# Altium project нижняя плата 2.0.PrjPcb
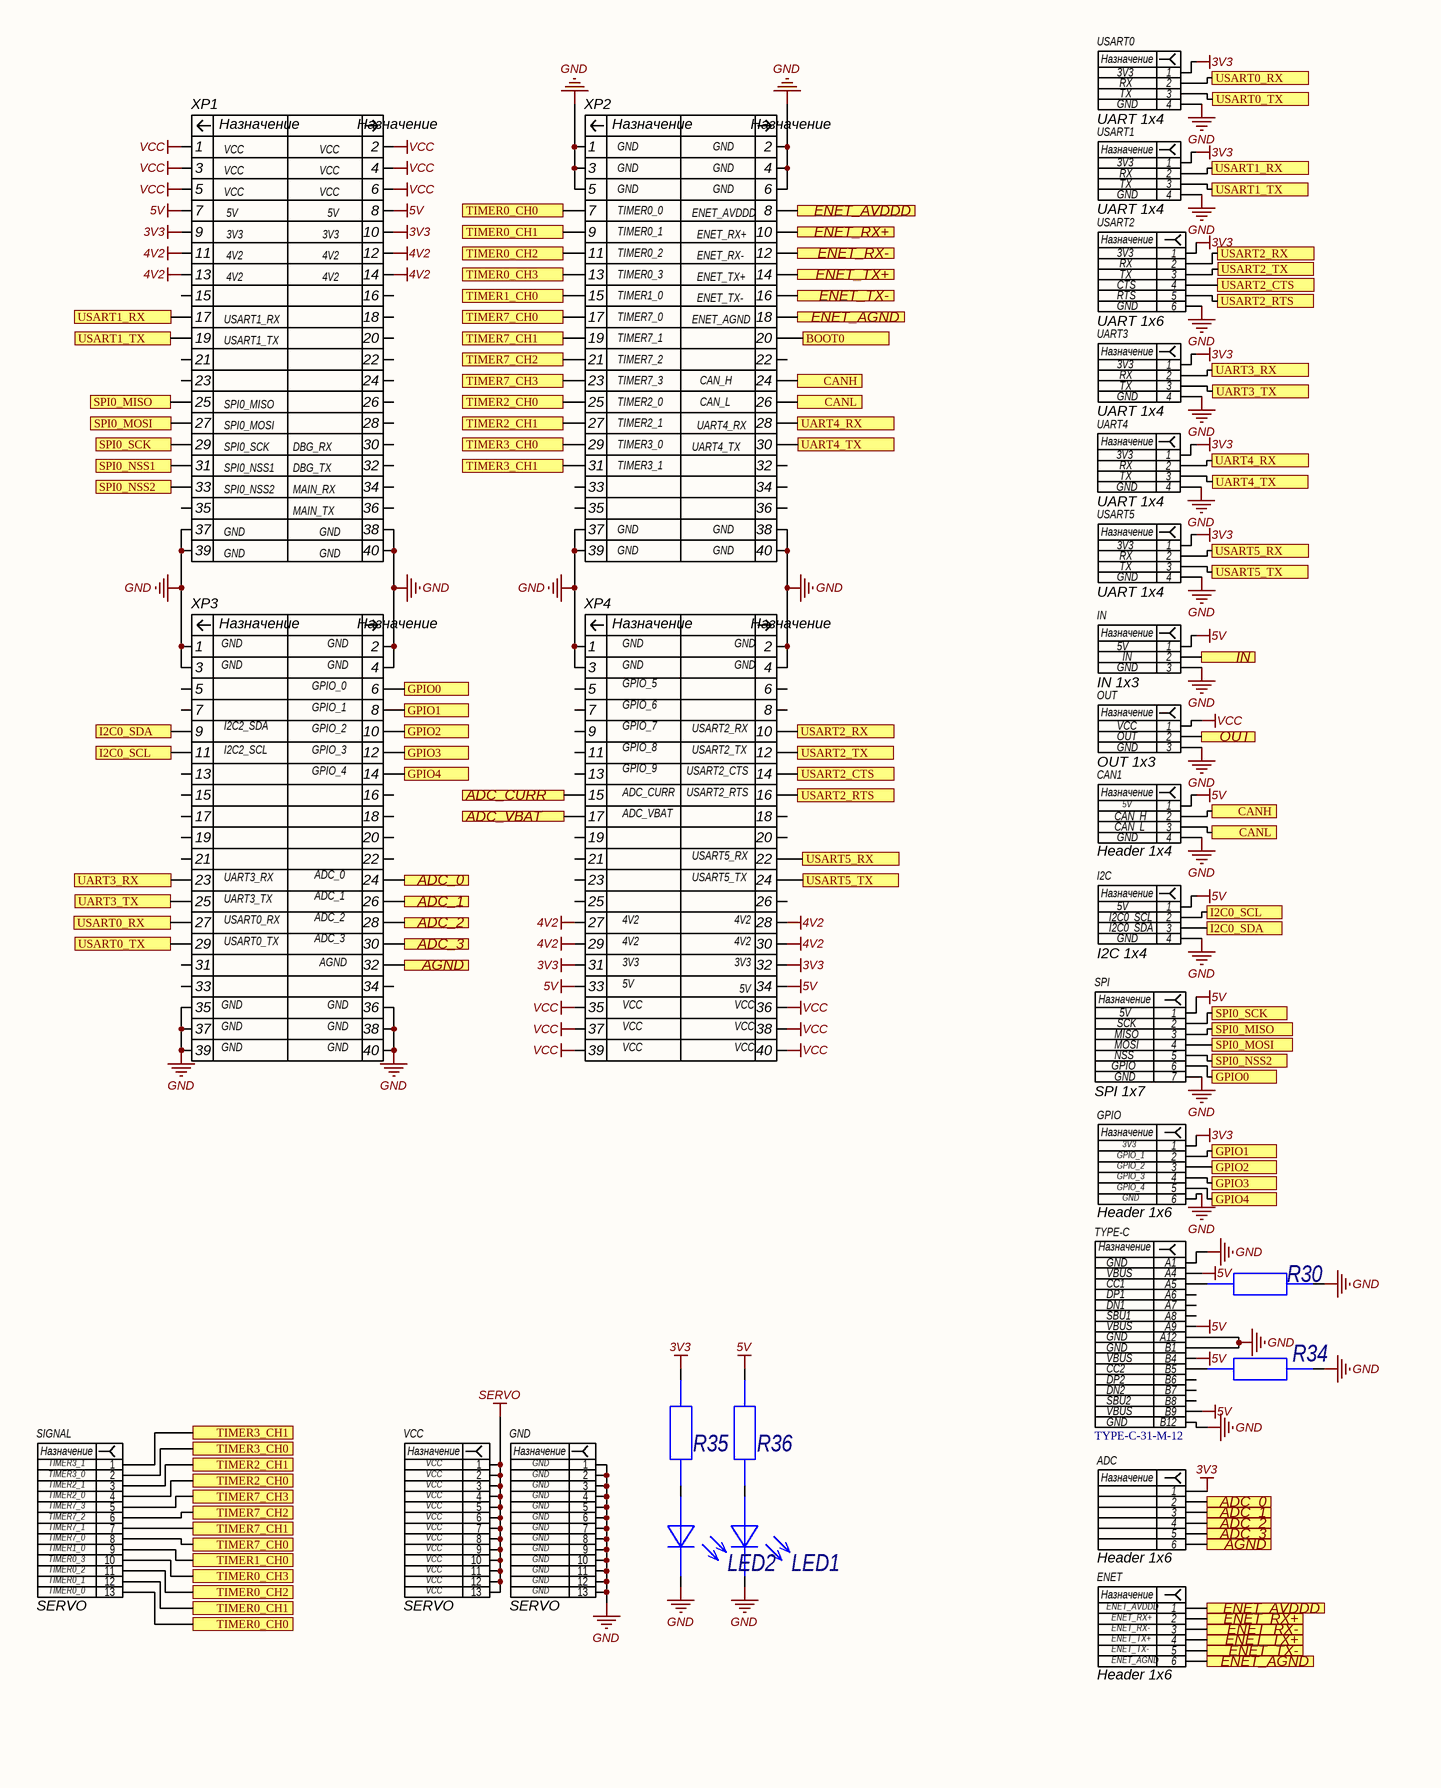
[diagram p0: нижняя плата версия 2.SchDoc, left]
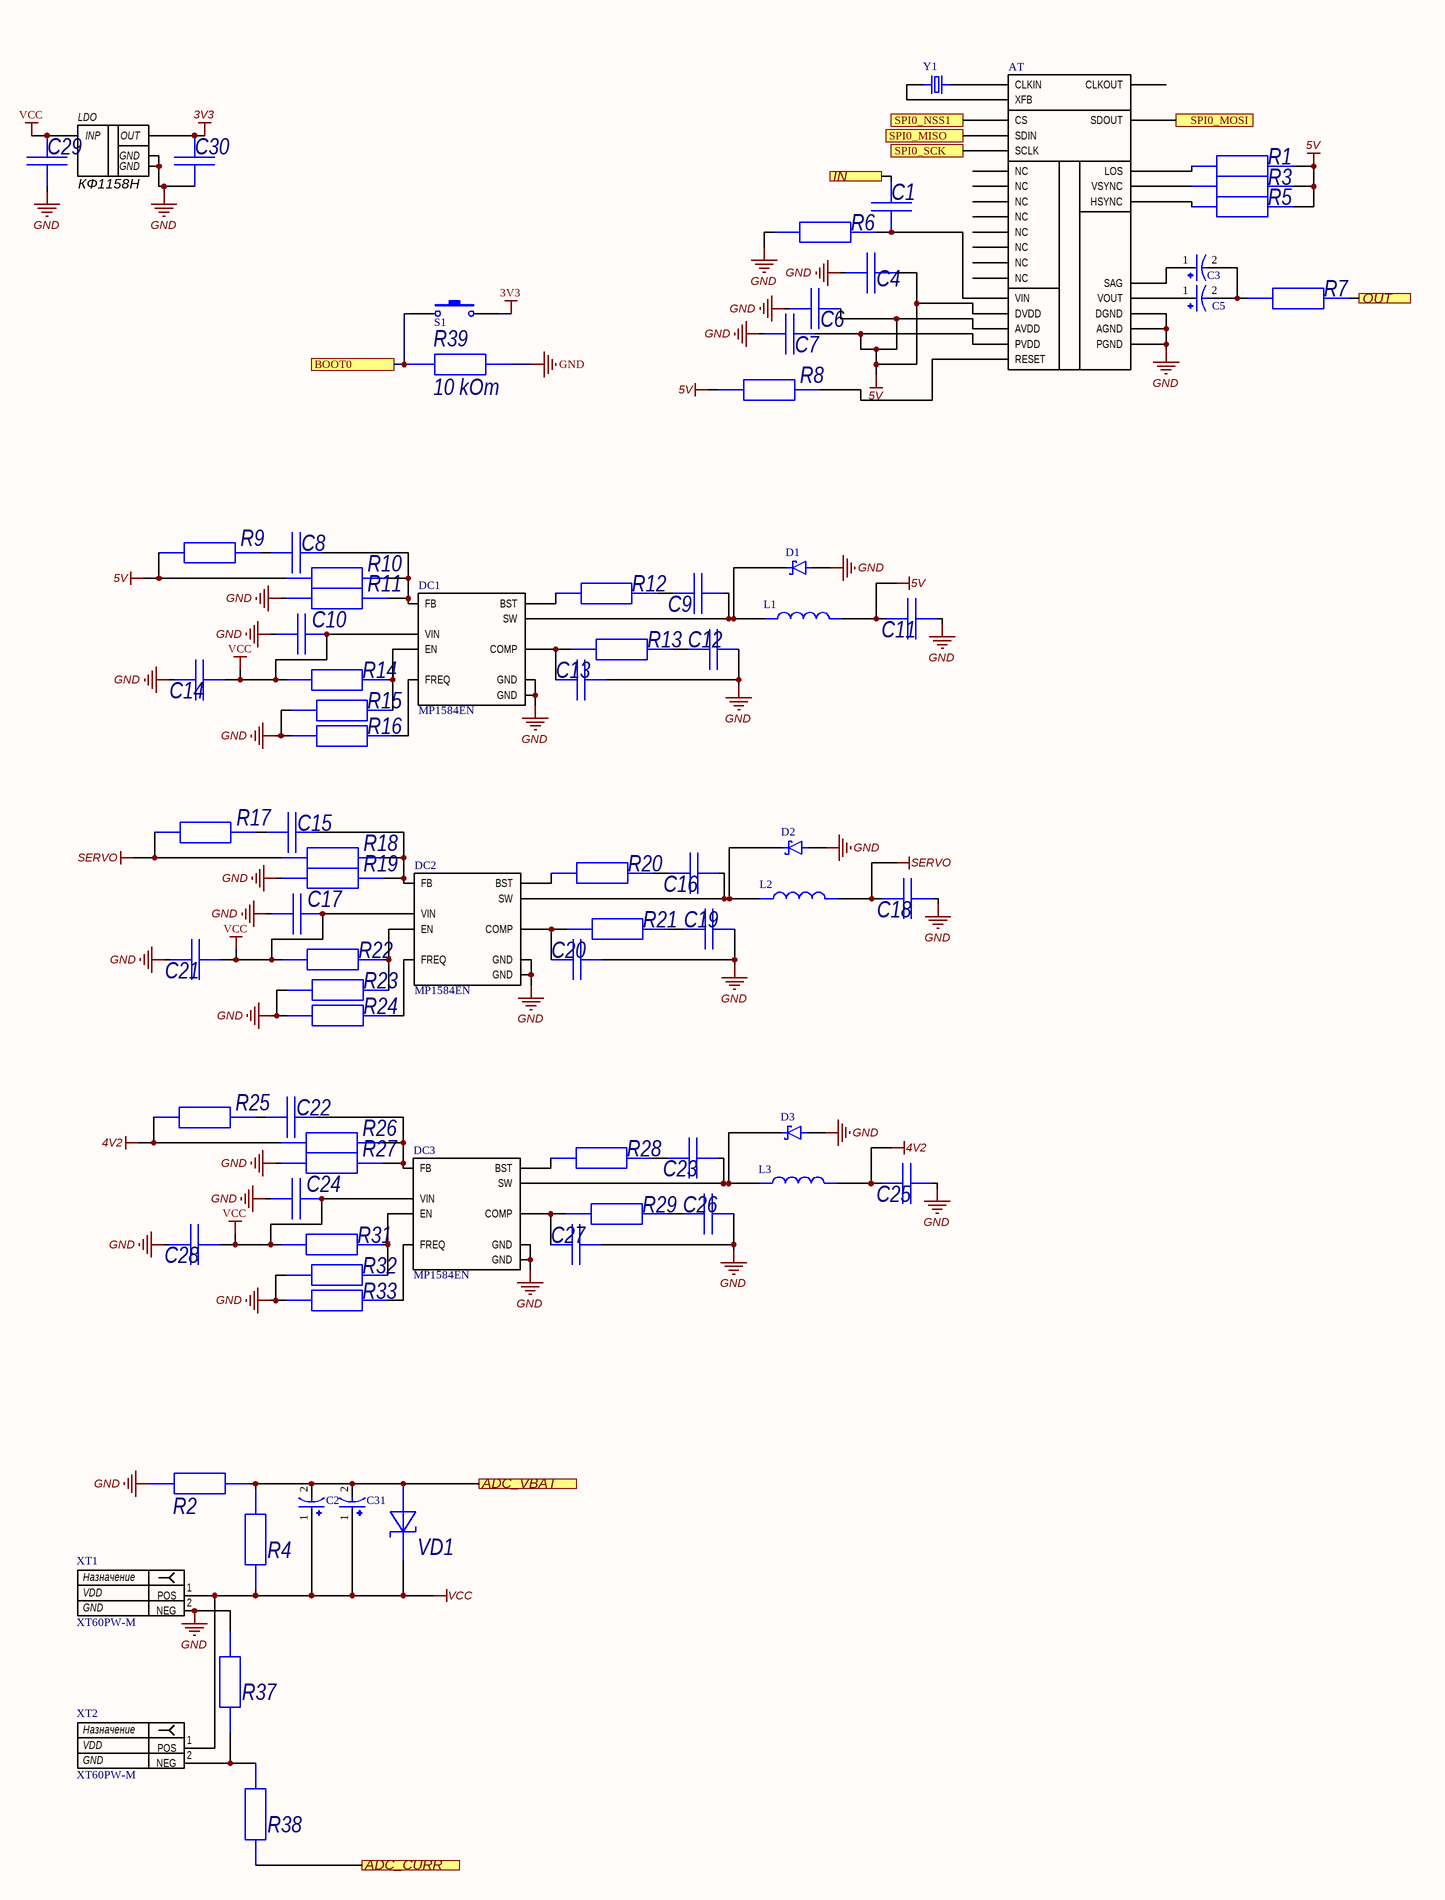
[diagram p1: нижняя плата версия 2.SchDoc, right]
1 sheet, 110 parts. Net scope: flat (ports and power ports of the same name join across sheets).
Board file: нижняя плата версия 4_13.03.PcbDoc

## Sheet нижняя плата версия 2.SchDoc
size A2; SheetNumber: 1; SheetTotal: 1

### Parts
ADC  Header 1x6  [PicoBlade 6pin]
AT  AT7456  [at7456]  (value not drawn)
C1  Capacitor  [C0603]  (value not drawn)
C2  T493B105K025BC6120  [CAPPM3528X210N]  (value not drawn)
C3  T493B105K025BC6120  [CAPPM3528X210N]  (value not drawn)
C4  Capacitor  [C0603]  (value not drawn)
C5  T493B105K025BC6120  [CAPPM3528X210N]  (value not drawn)
C6  Capacitor  [C0603]  (value not drawn)
C7  Capacitor  [C0603]  (value not drawn)
C8  22 pF  [C0603]  (value not drawn)
C9  0.1 uF  [C0603]  (value not drawn)
C10  0.1 uF  [C0603]  (value not drawn)
C11  22 uF  [C0603]  (value not drawn)
C12  330 pF  [C0603]  (value not drawn)
C13  1 pF  [C0603]  (value not drawn)
C14  4.7 uF  [C0603]  (value not drawn)
C15  22 pF  [C0603]  (value not drawn)
C16  0.1 uF  [C0603]  (value not drawn)
C17  0.1 uF  [C0603]  (value not drawn)
C18  22 uF  [C0603]  (value not drawn)
C19  330 pF  [C0603]  (value not drawn)
C20  1 pF  [C0603]  (value not drawn)
C21  4.7 uF  [C0603]  (value not drawn)
C22  22 pF  [C0603]  (value not drawn)
C23  0.1 uF  [C0603]  (value not drawn)
C24  0.1 uF  [C0603]  (value not drawn)
C25  33 uF  [C0603]  (value not drawn)
C26  330 pF  [C0603]  (value not drawn)
C27  2 pF  [C0603]  (value not drawn)
C28  4.7 uF  [C0603]  (value not drawn)
C29  0.1 uF  [C0603]  (value not drawn)
C30  10 uF  [C0603]  (value not drawn)
C31  T493B105K025BC6120  [CAPPM3528X210N]  (value not drawn)
CAN1  Header 1x4  [PicoBlade 4pin]
D1  B340A-13-F  [DIOM5226X240N]  (value not drawn)
D2  B340A-13-F  [DIOM5226X240N]  (value not drawn)
D3  B340A-13-F  [DIOM5226X240N]  (value not drawn)
DC1  MP1584EN  [SOIC127P600X170-9N]
DC2  MP1584EN  [SOIC127P600X170-9N]
DC3  MP1584EN  [SOIC127P600X170-9N]
ENET  Header 1x6  [PicoBlade 6pin]
GND  SERVO  [SERV]
GPIO  Header 1x6  [PicoBlade 6pin]
I2C  I2C 1x4  [PicoBlade 4pin]
IN  IN 1x3  [PicoBlade 3pin]
L1  12.3 uH  [IND_VLS6045EX-150M]  (value not drawn)
L2  12.3 uH  [IND_VLS6045EX-150M]  (value not drawn)
L3  12.3 uH  [IND_VLS6045EX-150M]  (value not drawn)
LDO  КФ1158Н  [ТО-263]
LED1  Text  [LD0805]  (value not drawn)
LED2  Text  [LD0805]  (value not drawn)
OUT  OUT 1x3  [PicoBlade 3pin]
R1  1 kOm  [R0603]  (value not drawn)
R2  (no value)  [R0603]
R3  1 kOm  [R0603]  (value not drawn)
R4  (no value)  [R0603]
R5  1 kOm  [R0603]  (value not drawn)
R6  10 kOm  [R0603]  (value not drawn)
R7  10 kOm  [R0603]  (value not drawn)
R8  10 kOm  [R0603]  (value not drawn)
R9  0  [R0603]  (value not drawn)
R10  124 kOm  [R0603]  (value not drawn)
R11  23.7 kOm  [R0603]  (value not drawn)
R12  0  [R0603]  (value not drawn)
R13  76.8 kOm  [R0603]  (value not drawn)
R14  100 kOm  [R0603]  (value not drawn)
R15  18.7 kOm  [R0603]  (value not drawn)
R16  193.38 kOm  [R0603]  (value not drawn)
R17  0  [R0603]  (value not drawn)
R18  124 kOm  [R0603]  (value not drawn)
R19  23.7 kOm  [R0603]  (value not drawn)
R20  0  [R0603]  (value not drawn)
R21  76.8 kOm  [R0603]  (value not drawn)
R22  100 kOm  [R0603]  (value not drawn)
R23  18.7 kOm  [R0603]  (value not drawn)
R24  193.38 kOm  [R0603]  (value not drawn)
R25  0  [R0603]  (value not drawn)
R26  124 kOm  [R0603]  (value not drawn)
R27  29 kOm  [R0603]  (value not drawn)
R28  0  [R0603]  (value not drawn)
R29  100 kOm  [R0603]  (value not drawn)
R30  10 kOm  [R0603]  (value not drawn)
R31  100 kOm  [R0603]  (value not drawn)
R32  18.7 kOm  [R0603]  (value not drawn)
R33  193.38 kOm  [R0603]  (value not drawn)
R34  10 kOm  [R0603]  (value not drawn)
R35  10 kOm  [R0603]  (value not drawn)
R36  10 kOm  [R0603]  (value not drawn)
R37  (no value)  [R2512]
R38  (no value)  [R0603]
R39  10 kOm  [R0603]
S1  SW-PB  [SWIT]  (value not drawn)
SIGNAL  SERVO  [SERV]
SPI  SPI 1x7  [PicoBlade 7pin]
TYPE-C  TYPE-C-31-M-12  [HRO_TYPE-C-31-M-12]
UART3  UART 1x4  [PicoBlade 4pin]
UART4  UART 1x4  [PicoBlade 4pin]
USART0  UART 1x4  [PicoBlade 4pin]
USART1  UART 1x4  [PicoBlade 4pin]
USART2  UART 1x6  [PicoBlade 6pin]
USART5  UART 1x4  [PicoBlade 4pin]
VCC  SERVO  [SERV]
VD1  Schottky  [DO-214AA]  (value not drawn)
XP1  PLLD-1.27-40S  [Headr 2x20 male]  (value not drawn)
XP2  PLLD-1.27-40S  [Headr 2x20 male]  (value not drawn)
XP3  PLLD-1.27-40S  [Headr 2x20 male]  (value not drawn)
XP4  PLLD-1.27-40S  [Headr 2x20 male]  (value not drawn)
XT1  XT60PW-M  [AMASS_XT60PW-M]
XT2  XT60PW-M  [AMASS_XT60PW-M]
Y1  ABM7-8.000MHZ-8-R80-D2Y-T  [XTAL_ABM7-8.000MHZ-8-R80-D2Y-T]  (value not drawn)

### Ports
ADC_0 (see нижняя плата версия 2[2B]), ADC_0 (see нижняя плата версия 2[4C]), ADC_1 (see нижняя плата версия 2[2B]), ADC_1 (see нижняя плата версия 2[4C]), ADC_2 (see нижняя плата версия 2[2B]), ADC_2 (see нижняя плата версия 2[4C]), ADC_3 (see нижняя плата версия 2[2B]), ADC_3 (see нижняя плата версия 2[4C]), ADC_CURR (see нижняя плата версия 2[2B]), ADC_CURR (see нижняя плата версия 2[5D]), ADC_VBAT (see нижняя плата версия 2[2B]), ADC_VBAT (see нижняя плата версия 2[6C]), AGND (see нижняя плата версия 2[2B]), AGND (see нижняя плата версия 2[4C]), BOOT0 (see нижняя плата версия 2[3A]), BOOT0 (see нижняя плата версия 2[5A]), CANH (see нижняя плата версия 2[3A]), CANH (see нижняя плата версия 2[4B]), CANL (see нижняя плата версия 2[3A]), CANL (see нижняя плата версия 2[4B]), ENET_AGND (see нижняя плата версия 2[3A]), ENET_AGND (see нижняя плата версия 2[4D]), ENET_AVDDD (see нижняя плата версия 2[3A]), ENET_AVDDD (see нижняя плата версия 2[4D]), ENET_RX+ (see нижняя плата версия 2[3A]), ENET_RX+ (see нижняя плата версия 2[4D]), ENET_RX- (see нижняя плата версия 2[3A]), ENET_RX- (see нижняя плата версия 2[4D]), ENET_TX+ (see нижняя плата версия 2[3A]), ENET_TX+ (see нижняя плата версия 2[4D]), ENET_TX- (see нижняя плата версия 2[3A]), ENET_TX- (see нижняя плата версия 2[4D]), GPIO0 (see нижняя плата версия 2[2B]), GPIO0 (see нижняя плата версия 2[4C]), GPIO1 (see нижняя плата версия 2[2B]), GPIO1 (see нижняя плата версия 2[4C]), GPIO2 (see нижняя плата версия 2[2B]), GPIO2 (see нижняя плата версия 2[4C]), GPIO3 (see нижняя плата версия 2[2B]), GPIO3 (see нижняя плата версия 2[4C]), GPIO4 (see нижняя плата версия 2[2B]), GPIO4 (see нижняя плата версия 2[4C]), I2C0_SCL (see нижняя плата версия 2[1B]), I2C0_SCL (see нижняя плата версия 2[4B]), I2C0_SDA (see нижняя плата версия 2[1B]), I2C0_SDA (see нижняя плата версия 2[4B]), IN (see нижняя плата версия 2[4B]), IN (see нижняя плата версия 2[7A]), OUT (see нижняя плата версия 2[4B]), OUT (see нижняя плата версия 2[8A]), SPI0_MISO (see нижняя плата версия 2[1A], нижняя плата версия 2[4C]), SPI0_MISO (see нижняя плата версия 2[1A], нижняя плата версия 2[7A]), SPI0_MISO (see нижняя плата версия 2[4C], нижняя плата версия 2[7A]), SPI0_MOSI (see нижняя плата версия 2[1A], нижняя плата версия 2[4C]), SPI0_MOSI (see нижняя плата версия 2[1A], нижняя плата версия 2[8A]), SPI0_MOSI (see нижняя плата версия 2[4C], нижняя плата версия 2[8A]), SPI0_NSS1 (see нижняя плата версия 2[1A]), SPI0_NSS1 (see нижняя плата версия 2[7A]), SPI0_NSS2 (see нижняя плата версия 2[1A]), SPI0_NSS2 (see нижняя плата версия 2[4C]), SPI0_SCK (see нижняя плата версия 2[1A], нижняя плата версия 2[4B]), SPI0_SCK (see нижняя плата версия 2[1A], нижняя плата версия 2[7A]), SPI0_SCK (see нижняя плата версия 2[4B], нижняя плата версия 2[7A]), TIMER0_CH0 (see нижняя плата версия 2[1D]), TIMER0_CH0 (see нижняя плата версия 2[2A]), TIMER0_CH1 (see нижняя плата версия 2[1D]), TIMER0_CH1 (see нижняя плата версия 2[2A]), TIMER0_CH2 (see нижняя плата версия 2[1D]), TIMER0_CH2 (see нижняя плата версия 2[2A]), TIMER0_CH3 (see нижняя плата версия 2[1D]), TIMER0_CH3 (see нижняя плата версия 2[2A]), TIMER1_CH0 (see нижняя плата версия 2[1D]), TIMER1_CH0 (see нижняя плата версия 2[2A]), TIMER2_CH0 (see нижняя плата версия 2[1C]), TIMER2_CH0 (see нижняя плата версия 2[2A]), TIMER2_CH1 (see нижняя плата версия 2[1C]), TIMER2_CH1 (see нижняя плата версия 2[2A]), TIMER3_CH0 (see нижняя плата версия 2[1C]), TIMER3_CH0 (see нижняя плата версия 2[2A]), TIMER3_CH1 (see нижняя плата версия 2[1C]), TIMER3_CH1 (see нижняя плата версия 2[2A]), TIMER7_CH0 (see нижняя плата версия 2[1C]), TIMER7_CH0 (see нижняя плата версия 2[2A]), TIMER7_CH1 (see нижняя плата версия 2[1C]), TIMER7_CH1 (see нижняя плата версия 2[2A]), TIMER7_CH2 (see нижняя плата версия 2[1C]), TIMER7_CH2 (see нижняя плата версия 2[2A]), TIMER7_CH3 (see нижняя плата версия 2[1C]), TIMER7_CH3 (see нижняя плата версия 2[2A]), UART3_RX (see нижняя плата версия 2[1B]), UART3_RX (see нижняя плата версия 2[4A]), UART3_TX (see нижняя плата версия 2[1B]), UART3_TX (see нижняя плата версия 2[4A]), UART4_RX (see нижняя плата версия 2[3A]), UART4_RX (see нижняя плата версия 2[4A]), UART4_TX (see нижняя плата версия 2[3A]), UART4_TX (see нижняя плата версия 2[4A]), USART0_RX (see нижняя плата версия 2[1B]), USART0_RX (see нижняя плата версия 2[4A]), USART0_TX (see нижняя плата версия 2[1B]), USART0_TX (see нижняя плата версия 2[4A]), USART1_RX (see нижняя плата версия 2[1A]), USART1_RX (see нижняя плата версия 2[4A]), USART1_TX (see нижняя плата версия 2[1A]), USART1_TX (see нижняя плата версия 2[4A]), USART2_CTS (see нижняя плата версия 2[3B]), USART2_CTS (see нижняя плата версия 2[4A]), USART2_RTS (see нижняя плата версия 2[3B]), USART2_RTS (see нижняя плата версия 2[4A]), USART2_RX (see нижняя плата версия 2[3B]), USART2_RX (see нижняя плата версия 2[4A]), USART2_TX (see нижняя плата версия 2[3B]), USART2_TX (see нижняя плата версия 2[4A]), USART5_RX (see нижняя плата версия 2[3B]), USART5_RX (see нижняя плата версия 2[4B]), USART5_TX (see нижняя плата версия 2[3B]), USART5_TX (see нижняя плата версия 2[4B])

### Nets
3V3: ADC.1 C30.2 GPIO.1 LDO.3(OUT) R35.2 S1.2 UART3.1 UART4.1 USART0.1 USART1.1 USART2.1 USART5.1 XP1.9 XP1.10 XP4.31 XP4.32
4V2: C25.1 L3.2 R25.2 R26.2 XP1.11 XP1.12 XP1.13 XP1.14 XP4.27 XP4.28 XP4.29 XP4.30
5V: AT.3(DVDD) AT.21(AVDD) AT.24(PVDD) C4.1 C6.1 C7.1 C11.1 CAN1.1 I2C.1 IN.1 L1.2 R1.2 R3.2 R5.2 R8.2 R9.2 R10.2 R36.2 SPI.1 TYPE-C.2(A4) TYPE-C.7(A9) TYPE-C.10(B4) TYPE-C.15(B9) XP1.7 XP1.8 XP4.33 XP4.34
GND: AT.4(DGND) AT.20(AGND) AT.23(PGND) C4.2 C6.2 C7.2 C10.1 C11.2 C12.2 C13.2 C14.1 C17.1 C18.2 C19.2 C20.2 C21.1 C24.1 C25.2 C26.2 C27.2 C28.1 C29.1 C30.1 CAN1.4 D1.A D2.A D3.A DC1.5(GND) DC1.9(GND) DC2.5(GND) DC2.9(GND) DC3.5(GND) DC3.9(GND) GND.1 GND.2 GND.3 GND.4 GND.5 GND.6 GND.7 GND.8 GND.9 GND.10 GND.11 GND.12 GND.13 GPIO.6 I2C.4 IN.3 LDO.2(GND) LDO.4(GND) LED1.2(К) LED2.2(К) OUT.3 R2.2 R6.1 R11.2 R15.2 R16.2 R19.2 R23.2 R24.2 R27.2 R30.2 R32.2 R33.2 R34.2 R37.2 R39.1 SPI.7 TYPE-C.1(A1) TYPE-C.8(A12) TYPE-C.9(B1) TYPE-C.16(B12) UART3.4 UART4.4 USART0.4 USART1.4 USART2.6 USART5.4 XP1.37 XP1.38 XP1.39 XP1.40 XP2.1 XP2.2 XP2.3 XP2.4 XP2.5 XP2.6 XP2.37 XP2.38 XP2.39 XP2.40 XP3.1 XP3.2 XP3.3 XP3.4 XP3.35 XP3.36 XP3.37 XP3.38 XP3.39 XP3.40 XP4.1 XP4.2 XP4.3 XP4.4 XT1.2(NEG)
SERVO: C18.1 L2.2 R17.2 R18.2 VCC.1 VCC.2 VCC.3 VCC.4 VCC.5 VCC.6 VCC.7 VCC.8 VCC.9 VCC.10 VCC.11 VCC.12 VCC.13
VCC: C2.1 C10.2 C14.2 C17.2 C21.2 C24.2 C28.2 C29.2 C31.1 DC1.7(VIN) DC2.7(VIN) DC3.7(VIN) LDO.1(INP) OUT.1 R4.2 R14.2 R22.2 R31.2 VD1.2(К) XP1.1 XP1.2 XP1.3 XP1.4 XP1.5 XP1.6 XP4.35 XP4.36 XP4.37 XP4.38 XP4.39 XP4.40 XT1.1(POS) XT2.1(POS)
NetADC_2: ADC.2 XP3.24 ; port ADC_0
NetADC_3: ADC.3 XP3.26 ; port ADC_1
NetADC_4: ADC.4 XP3.28 ; port ADC_2
NetADC_5: ADC.5 XP3.30 ; port ADC_3
NetADC_6: ADC.6 XP3.32 ; port AGND
NetAT_5: AT.5(CLKIN) Y1.2
NetAT_6: AT.6(XFB) Y1.1
NetAT_8: AT.8(CS) XP1.31 ; port SPI0_NSS1
NetAT_9: AT.9(SDIN) SPI.3 XP1.25 ; port SPI0_MISO
NetAT_10: AT.10(SCLK) SPI.2 XP1.29 ; port SPI0_SCK
NetAT_11: AT.11(SDOUT) SPI.4 XP1.27 ; port SPI0_MOSI
NetAT_12: AT.12(LOS) R1.1
NetAT_17: AT.17(VSYNC) R3.1
NetAT_18: AT.18(HSYNC) R5.1
NetAT_19: AT.19(RESET) R8.1
NetAT_22: AT.22(VIN) C1.1 R6.2
NetAT_25: AT.25(SAG) C3.1
NetAT_26: AT.26(VOUT) C5.1
NetC1_2: C1.2 IN.2 ; port IN
NetC2_2: C2.2 C31.2 R2.1 R4.1 VD1.1(А) XP4.17 ; port ADC_VBAT
NetC3_2: C3.2 C5.2 R7.1
NetC8_1: C8.1 R9.1
NetC8_2: C8.2 DC1.4(FB) R10.1 R11.1
NetC9_1: C9.1 R12.1
NetC9_2: C9.2 D1.C DC1.1(SW) L1.1
NetC12_1: C12.1 R13.1
NetC13_1: C13.1 DC1.3(COMP) R13.2
NetC15_1: C15.1 R17.1
NetC15_2: C15.2 DC2.4(FB) R18.1 R19.1
NetC16_1: C16.1 R20.1
NetC16_2: C16.2 D2.C DC2.1(SW) L2.1
NetC19_1: C19.1 R21.1
NetC20_1: C20.1 DC2.3(COMP) R21.2
NetC22_1: C22.1 R25.1
NetC22_2: C22.2 DC3.4(FB) R26.1 R27.1
NetC23_1: C23.1 R28.1
NetC23_2: C23.2 D3.C DC3.1(SW) L3.1
NetC26_1: C26.1 R29.1
NetC27_1: C27.1 DC3.3(COMP) R29.2
NetCAN1_2: CAN1.2 XP2.24 ; port CANH
NetCAN1_3: CAN1.3 XP2.26 ; port CANL
NetDC1_2: DC1.2(EN) R14.1 R15.1
NetDC1_6: DC1.6(FREQ) R16.1
NetDC1_8: DC1.8(BST) R12.2
NetDC2_2: DC2.2(EN) R22.1 R23.1
NetDC2_6: DC2.6(FREQ) R24.1
NetDC2_8: DC2.8(BST) R20.2
NetDC3_2: DC3.2(EN) R31.1 R32.1
NetDC3_6: DC3.6(FREQ) R33.1
NetDC3_8: DC3.8(BST) R28.2
NetENET_1: ENET.1 XP2.8 ; port ENET_AVDDD
NetENET_2: ENET.2 XP2.10 ; port ENET_RX+
NetENET_3: ENET.3 XP2.12 ; port ENET_RX-
NetENET_4: ENET.4 XP2.14 ; port ENET_TX+
NetENET_5: ENET.5 XP2.16 ; port ENET_TX-
NetENET_6: ENET.6 XP2.18 ; port ENET_AGND
NetGPIO_2: GPIO.2 XP3.8 ; port GPIO1
NetGPIO_3: GPIO.3 XP3.10 ; port GPIO2
NetGPIO_4: GPIO.4 XP3.12 ; port GPIO3
NetGPIO_5: GPIO.5 XP3.14 ; port GPIO4
NetI2C_2: I2C.2 XP3.11 ; port I2C0_SCL
NetI2C_3: I2C.3 XP3.9 ; port I2C0_SDA
NetLED1_1: LED1.1(А) R36.1
NetLED2_1: LED2.1(А) R35.1
NetOUT_2: OUT.2 R7.2 ; port OUT
NetR30_1: R30.1 TYPE-C.3(A5)
NetR34_1: R34.1 TYPE-C.11(B5)
NetR37_1: R37.1 R38.2 XT2.2(NEG)
NetR38_1: R38.1 XP4.15 ; port ADC_CURR
NetR39_2: R39.2 S1.1 XP2.20 ; port BOOT0
NetSIGNAL_1: SIGNAL.1 XP2.31 ; port TIMER3_CH1
NetSIGNAL_2: SIGNAL.2 XP2.29 ; port TIMER3_CH0
NetSIGNAL_3: SIGNAL.3 XP2.27 ; port TIMER2_CH1
NetSIGNAL_4: SIGNAL.4 XP2.25 ; port TIMER2_CH0
NetSIGNAL_5: SIGNAL.5 XP2.23 ; port TIMER7_CH3
NetSIGNAL_6: SIGNAL.6 XP2.21 ; port TIMER7_CH2
NetSIGNAL_7: SIGNAL.7 XP2.19 ; port TIMER7_CH1
NetSIGNAL_8: SIGNAL.8 XP2.17 ; port TIMER7_CH0
NetSIGNAL_9: SIGNAL.9 XP2.15 ; port TIMER1_CH0
NetSIGNAL_10: SIGNAL.10 XP2.13 ; port TIMER0_CH3
NetSIGNAL_11: SIGNAL.11 XP2.11 ; port TIMER0_CH2
NetSIGNAL_12: SIGNAL.12 XP2.9 ; port TIMER0_CH1
NetSIGNAL_13: SIGNAL.13 XP2.7 ; port TIMER0_CH0
NetSPI_5: SPI.5 XP1.33 ; port SPI0_NSS2
NetSPI_6: SPI.6 XP3.6 ; port GPIO0
NetUART3_2: UART3.2 XP3.23 ; port UART3_RX
NetUART3_3: UART3.3 XP3.25 ; port UART3_TX
NetUART4_2: UART4.2 XP2.28 ; port UART4_RX
NetUART4_3: UART4.3 XP2.30 ; port UART4_TX
NetUSART0_2: USART0.2 XP3.27 ; port USART0_RX
NetUSART0_3: USART0.3 XP3.29 ; port USART0_TX
NetUSART1_2: USART1.2 XP1.17 ; port USART1_RX
NetUSART1_3: USART1.3 XP1.19 ; port USART1_TX
NetUSART2_2: USART2.2 XP4.10 ; port USART2_RX
NetUSART2_3: USART2.3 XP4.12 ; port USART2_TX
NetUSART2_4: USART2.4 XP4.14 ; port USART2_CTS
NetUSART2_5: USART2.5 XP4.16 ; port USART2_RTS
NetUSART5_2: USART5.2 XP4.22 ; port USART5_RX
NetUSART5_3: USART5.3 XP4.24 ; port USART5_TX

Not connected (* = marked no-connect by the designer): AT 1(NC) 2(NC) 7(CLKOUT) 13(NC) 14(NC) 15(NC) 16(NC) 27(NC) 28(NC); TYPE-C 4(A6) 5(A7) 6(A8) 12(B6) 13(B7) 14(B8); XP1 15 16 18 20 21 22 23 24 26 28 30 32 34 35 36; XP2 22 32 33 34 35 36; XP3 5 7 13 15 16 17 18 19 20 21 22 31 33 34; XP4 5 6 7 8 9 11 13 18 19 20 21 23 25 26

### Notes on the sheet
- (near XP1) VCC
- (near XP2) GND
- (near XP1) 5V
- (near XP2) TIMER0_0
- (near XP2) ENET_AVDDD
- (near XP1) 3V3
- (near XP1) 4V2
- (near XP2) TIMER0_1
- (near XP2) TIMER0_2
- (near XP2) TIMER0_3
- (near XP2) ENET_RX-
- (near XP2) ENET_RX+
- (near XP2) ENET_TX+
- (near XP1) USART1_RX
- (near XP1) USART1_TX
- (near XP2) TIMER1_0
- (near XP2) TIMER7_0
- (near XP2) TIMER7_1
- (near XP2) ENET_AGND
- (near XP2) ENET_TX-
- (near XP1) SPI0_MISO
- (near XP2) TIMER7_2
- (near XP2) TIMER7_3
- (near XP2) TIMER2_0
- (near XP2) CAN_H
- (near XP2) CAN_L
- (near XP1) SPI0_MOSI
- (near XP1) SPI0_SCK
- (near XP1) SPI0_NSS1
- (near XP1) DBG_RX
- (near XP1) DBG_TX
- (near XP2) TIMER2_1
- (near XP2) TIMER3_0
- (near XP2) TIMER3_1
- (near XP2) UART4_TX
- (near XP2) UART4_RX
- (near XP1) SPI0_NSS2
- (near XP1) GND
- (near XP1) MAIN_RX
- (near XP1) MAIN_TX
- (near XP3) GND
- (near XP3) GPIO_0
- (near XP4) GPIO_5
- (near XP4) GND
- (near XP3) I2C2_SCL
- (near XP3) I2C2_SDA
- (near XP3) GPIO_1
- (near XP3) GPIO_2
- (near XP3) GPIO_3
- (near XP4) GPIO_6
- (near XP4) GPIO_7
- (near XP4) GPIO_8
- (near XP4) USART2_TX
- (near XP4) USART2_RX
- (near XP3) GPIO_4
- (near XP4) GPIO_9
- (near XP4) ADC_CURR
- (near XP4) ADC_VBAT
- (near XP4) USART2_CTS
- (near XP4) USART2_RTS
- (near CAN1) CAN_H
- 5V
- (near XP3) UART3_RX
- (near XP3) ADC_0
- (near XP4) USART5_RX
- (near XP4) USART5_TX
- (near CAN1) CAN_L
- (near CAN1) GND
- (near XP3) USART0_TX
- (near XP3) USART0_RX
- (near XP3) UART3_TX
- (near XP3) ADC_1
- (near XP3) ADC_2
- (near XP3) ADC_3
- (near XP4) 4V2
- (near XP3) AGND
- (near XP4) 5V
- (near XP4) 3V3
- (near XP4) VCC
- (near GPIO) GPIO_1
- (near GPIO) 3V3
- (near GPIO) GPIO_2
- (near GPIO) GPIO_3
- (near GPIO) GPIO_4
- GND
- (near SIGNAL) TIMER2_0
- (near SIGNAL) TIMER2_1
- (near SIGNAL) TIMER3_0
- (near SIGNAL) TIMER3_1
- (near VCC) VCC
- (near SIGNAL) TIMER0_3
- (near SIGNAL) TIMER1_0
- (near SIGNAL) TIMER7_0
- (near SIGNAL) TIMER7_1
- (near SIGNAL) TIMER7_2
- (near SIGNAL) TIMER7_3
- (near SIGNAL) TIMER0_0
- (near SIGNAL) TIMER0_1
- (near SIGNAL) TIMER0_2
- (near ENET) ENET_AVDDD
- (near ENET) ENET_RX-
- (near ENET) ENET_RX+
- (near ENET) ENET_TX+
- (near ENET) ENET_TX-
- (near ENET) ENET_AGND
- (in symbol Header 1x4) Назначение
- (in symbol Header 1x6) Назначение
- (in symbol I2C 1x4) Назначение; 5V; I2C0_SCL; I2C0_SDA; GND
- (in symbol IN 1x3) Назначение; 5V; GND
- (in symbol OUT 1x3) Назначение; VCC; GND
- (in symbol PLLD-1.27-40S) Назначение
- (in symbol SERVO) Назначение
- (in symbol SPI 1x7) Назначение; 5V; SCK; MISO; MOSI; NSS; GPIO; GND
- (in symbol TYPE-C-31-M-12) Назначение; GND; VBUS; CC1; DP1; DN1; SBU1; CC2; DP2; DN2; SBU2
- (in symbol UART 1x4) Назначение; 3V3; RX; TX; GND
- (in symbol UART 1x6) Назначение; 3V3; RX; TX; CTS; RTS; GND
- (in symbol XT60PW-M) Назначение; VDD; GND

### Library data of the parts
AT = AT7456: OSD
C1 C4 C6-C30 = Capacitor: Type: Конденсатор; Published: 18.05.2010; Publisher: Andrew Danich
C2 C3 C5 C31 = T493B105K025BC6120: Tantalum Surface Mount Capacitors; MF: KEMET; Package: SMD-2 Kemet; MP: T493B105K025BC6120; SnapEDA_Link: https://www.snapeda.com/parts/T493B105K025BC6120/KEMET/view-part/?ref=snap; Value: *; Availability: In Stock; Price: None; Check_prices: https://www.snapeda.com/parts/T493B105K025BC6120/KEMET/view-part/?ref=eda
D1-D3 = B340A-13-F: Diode, Rectifier, 3a, 40v, Do-214ac, Full Reel; Price: None; Value: *; MP: B340A-13-F; Package: None; Availability: Unavailable
L1-L3 = VLS6045EX-150M: 15 ÂµH Shielded Drum Core, Wirewound Inductor 2.5 A 75mOhm Nonstandard; MF: TDK; Value: *; SnapEDA_Link: https://www.snapeda.com/parts/VLS6045EX-150M/TDK/view-part/?ref=snap; Availability: In Stock; Price: None; Check_prices: https://www.snapeda.com/parts/VLS6045EX-150M/TDK/view-part/?ref=eda; Purchase-URL: https://pricing.snapeda.com/search/part/VLS6045EX-150M/?ref=eda; Package: NON STANDARD-2 TDK; MP: VLS6045EX-150M
LED1 LED2 = Led-1: Type: Индикатор единичный; Published: 03.12.2013; Publisher: Andrew Danich
R1-R39 = Resistor: Published: 24.03.2010; Publisher: Andrew Danich; Type: Резистор
S1 = SW-PB: Switch; Published: 24-Mar-1999; LatestRevisionDate: 17-Jul-2002; LatestRevisionNote: Re-released for DXP Platform.; PackageReference: SPST-2; Publisher: Altium Limited; PackageDescription: Switch; 2 Leads
VD1 = Schottky: Type: Диод; Published: 18.05.2010; Publisher: Andrew Danich
Y1 = ABM7-8.000MHZ-8-R80-D2Y-T: Crystal 22.1184MHz Ã‚Â±20ppm (Tol) Ã‚Â±30ppm (Stability) 18pF FUND 50Ohm 2-Pin Mini-CSMD T/R; Package: None; Price: None; Value: *; MP: ABM7-8.000MHZ-8-R80-D2Y-T; Availability: Unavailable